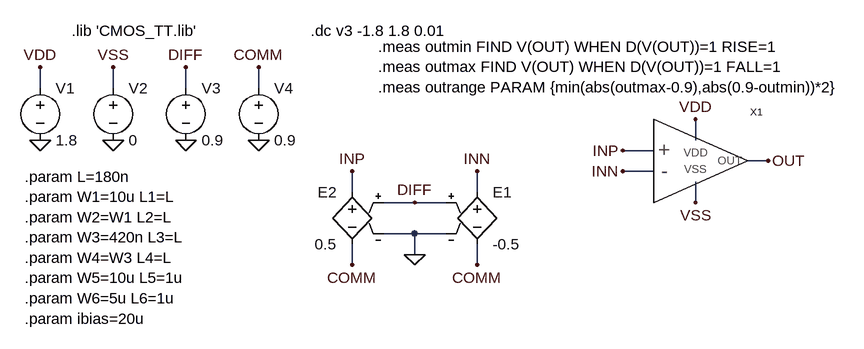
[diagram p0: schematic tb_dc_diff.asc]
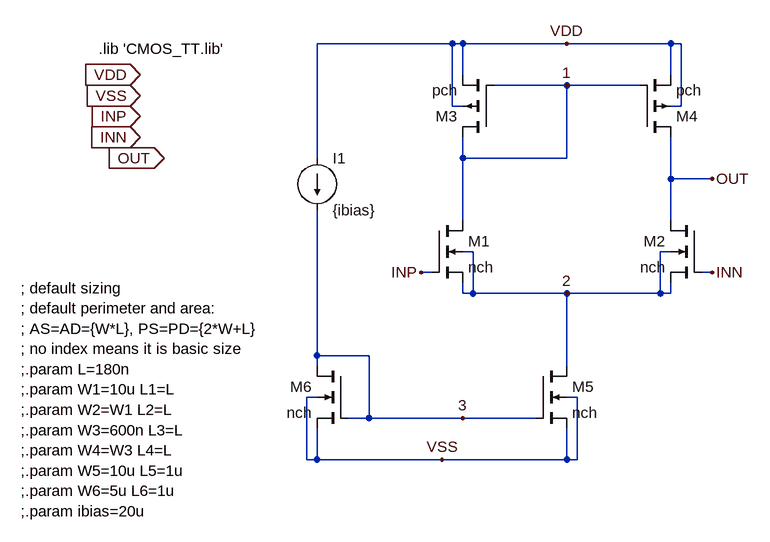
[diagram p1: sub-circuit opamp1stage_good.asc]
tb_dc_diff.asc, the LTspice schematic file:
Version 4
SHEET 1 1168 680
WIRE -176 -96 -176 -128
WIRE -64 -96 -64 -128
WIRE 48 -96 48 -128
WIRE 160 -96 160 -128
WIRE 832 -16 832 -48
WIRE 768 0 720 0
WIRE 944 16 912 16
WIRE 768 32 720 32
WIRE 304 64 304 32
WIRE 496 64 496 32
WIRE 400 80 352 80
WIRE 448 80 400 80
WIRE 832 80 832 48
WIRE 400 128 352 128
WIRE 448 128 400 128
WIRE 400 160 400 128
WIRE 304 176 304 144
WIRE 496 176 496 144
FLAG -176 -16 0
FLAG -64 -16 0
FLAG -176 -128 VDD
FLAG -64 -128 VSS
FLAG 832 -48 VDD
FLAG 832 80 VSS
FLAG 944 16 OUT
FLAG 48 -16 0
FLAG 48 -128 DIFF
FLAG 720 0 INP
FLAG 720 32 INN
FLAG 160 -16 0
FLAG 160 -128 COMM
FLAG 304 176 COMM
FLAG 496 176 COMM
FLAG 400 160 0
FLAG 400 80 DIFF
FLAG 304 32 INP
FLAG 496 32 INN
SYMBOL voltage -176 -112 R0
WINDOW 123 0 0 Left 0
WINDOW 39 0 0 Left 0
SYMATTR InstName V1
SYMATTR Value 1.8
SYMBOL voltage -64 -112 R0
WINDOW 123 0 0 Left 0
WINDOW 39 0 0 Left 0
SYMATTR InstName V2
SYMATTR Value 0
SYMBOL opamp1stage_good 816 16 R0
SYMATTR InstName X1
SYMBOL voltage 48 -112 R0
WINDOW 123 0 0 Left 0
WINDOW 39 0 0 Left 0
SYMATTR InstName V3
SYMATTR Value 0.9
SYMBOL voltage 160 -112 R0
WINDOW 123 0 0 Left 0
WINDOW 39 0 0 Left 0
SYMATTR InstName V4
SYMATTR Value 0.9
SYMBOL e 496 48 R0
SYMATTR InstName E1
SYMATTR Value -0.5
SYMBOL e 304 48 M0
SYMATTR InstName E2
SYMATTR Value 0.5
TEXT 240 -184 Left 2 !.dc v3 -1.8 1.8 0.01
TEXT -200 40 Left 2 !.param L=180n\n.param W1=10u L1=L\n.param W2=W1 L2=L\n.param W3=420n L3=L\n.param W4=W3 L4=L\n.param W5=10u L5=1u\n.param W6=5u L6=1u\n.param ibias=20u
TEXT -128 -184 Left 2 !.lib 'CMOS_TT.lib'
TEXT 344 -160 Left 2 !.meas outmin FIND V(OUT) WHEN D(V(OUT))=1 RISE=1\n.meas outmax FIND V(OUT) WHEN D(V(OUT))=1 FALL=1\n.meas outrange PARAM {min(abs(outmax-0.9),abs(0.9-outmin))*2}

opamp1stage_good.asc, the sub-circuit schematic file:
Version 4
SHEET 1 1168 680
WIRE 512 -176 304 -176
WIRE 528 -176 512 -176
WIRE 688 -176 528 -176
WIRE 848 -176 688 -176
WIRE 864 -176 848 -176
WIRE 528 -128 528 -176
WIRE 848 -128 848 -176
WIRE 688 -112 576 -112
WIRE 800 -112 688 -112
WIRE 512 -80 512 -176
WIRE 528 -80 512 -80
WIRE 864 -80 864 -176
WIRE 864 -80 848 -80
WIRE 304 0 304 -176
WIRE 528 0 528 -32
WIRE 688 0 688 -112
WIRE 688 0 528 0
WIRE 848 32 848 -32
WIRE 912 32 848 32
WIRE 528 96 528 0
WIRE 848 96 848 32
WIRE 544 144 528 144
WIRE 848 144 832 144
WIRE 480 176 464 176
WIRE 912 176 896 176
WIRE 528 208 528 192
WIRE 544 208 544 144
WIRE 544 208 528 208
WIRE 688 208 544 208
WIRE 832 208 832 144
WIRE 832 208 688 208
WIRE 848 208 848 192
WIRE 848 208 832 208
WIRE 304 304 304 80
WIRE 384 304 304 304
WIRE 304 320 304 304
WIRE 688 320 688 208
WIRE 304 368 288 368
WIRE 704 368 688 368
WIRE 384 400 384 304
WIRE 384 400 352 400
WIRE 528 400 384 400
WIRE 640 400 528 400
WIRE 288 464 288 368
WIRE 304 464 304 416
WIRE 304 464 288 464
WIRE 496 464 304 464
WIRE 688 464 688 416
WIRE 688 464 496 464
WIRE 704 464 704 368
WIRE 704 464 688 464
FLAG 496 464 VSS
FLAG 464 176 INP
FLAG 912 176 INN
FLAG 688 -176 VDD
FLAG 688 -112 1
FLAG 688 208 2
FLAG 528 400 3
FLAG 912 32 OUT
FLAG 32 -128 VDD
IOPIN 32 -128 In
FLAG 32 -96 VSS
IOPIN 32 -96 In
FLAG 32 -64 INP
IOPIN 32 -64 In
FLAG 32 -32 INN
IOPIN 32 -32 In
FLAG -16 0 OUT
IOPIN -16 0 Out
SYMBOL nmos4 480 96 R0
SYMATTR InstName M1
SYMATTR Value nch
SYMATTR Value2 l={L1} w={W1} ad={W1*L1} as={W1*L1} pd={2*W1+L1} ps={2*W1+L1}
SYMBOL nmos4 896 96 M0
SYMATTR InstName M2
SYMATTR Value nch
SYMATTR Value2 l={L2} w={W2} ad={W2*L2} as={W2*L2} pd={2*W2+L2} ps={2*W2+L2}
SYMBOL pmos4 576 -32 R180
SYMATTR InstName M3
SYMATTR Value pch
SYMATTR Value2 l={L3} w={W3} ad={W3*L3} as={W3*L3} pd={2*W3+L3} ps={2*W3+L3}
SYMBOL pmos4 800 -32 M180
SYMATTR InstName M4
SYMATTR Value pch
SYMATTR Value2 l={L4} w={W4} ad={W4*L4} as={W4*L4} pd={2*W4+L4} ps={2*W4+L4}
SYMBOL nmos4 640 320 R0
SYMATTR InstName M5
SYMATTR Value nch
SYMATTR Value2 l={L5} w={W5} ad={W5*L5} as={W5*L5} pd={2*W5+L5} ps={2*W5+L5}
SYMBOL nmos4 352 320 M0
SYMATTR InstName M6
SYMATTR Value nch
SYMATTR Value2 l={L6} w={W6} ad={W6*L6} as={W6*L6} pd={2*W6+L6} ps={2*W6+L6}
SYMBOL current 304 0 R0
WINDOW 123 0 0 Left 0
WINDOW 39 0 0 Left 0
SYMATTR InstName I1
SYMATTR Value {ibias}
TEXT -32 -168 Left 2 !.lib 'CMOS_TT.lib'
TEXT -152 200 Left 2 !; default sizing\n; default perimeter and area:\n; AS=AD={W*L}, PS=PD={2*W+L}\n; no index means it is basic size\n;.param L=180n\n;.param W1=10u L1=L\n;.param W2=W1 L2=L\n;.param W3=600n L3=L\n;.param W4=W3 L4=L\n;.param W5=10u L5=1u\n;.param W6=5u L6=1u\n;.param ibias=20u

The netlist it stands for:
* tb_dc_diff.asc
V1 VDD 0 1.8
V2 VSS 0 0
XX1 OUT INP INN VDD VSS opamp1stage_good
V3 DIFF 0 0.9
V4 COMM 0 0.9
E1 INN COMM DIFF 0 -0.5
E2 INP COMM DIFF 0 0.5

* block symbol definitions
.subckt opamp1stage_good OUT INP INN VDD VSS
M1 1 INP 2 2 nch l={L1} w={W1} ad={W1*L1} as={W1*L1} pd={2*W1+L1} ps={2*W1+L1}
M2 OUT INN 2 2 nch l={L2} w={W2} ad={W2*L2} as={W2*L2} pd={2*W2+L2} ps={2*W2+L2}
M3 1 1 VDD VDD pch l={L3} w={W3} ad={W3*L3} as={W3*L3} pd={2*W3+L3} ps={2*W3+L3}
M4 OUT 1 VDD VDD pch l={L4} w={W4} ad={W4*L4} as={W4*L4} pd={2*W4+L4} ps={2*W4+L4}
M5 2 3 VSS VSS nch l={L5} w={W5} ad={W5*L5} as={W5*L5} pd={2*W5+L5} ps={2*W5+L5}
M6 3 3 VSS VSS nch l={L6} w={W6} ad={W6*L6} as={W6*L6} pd={2*W6+L6} ps={2*W6+L6}
I1 VDD 3 {ibias}
.lib 'CMOS_TT.lib'
; default sizing
; default perimeter and area:
; AS=AD={W*L}, PS=PD={2*W+L}
; no index means it is basic size
;.param L=180n
;.param W1=10u L1=L
;.param W2=W1 L2=L
;.param W3=600n L3=L
;.param W4=W3 L4=L
;.param W5=10u L5=1u
;.param W6=5u L6=1u
;.param ibias=20u
.ends opamp1stage_good

.model NMOS NMOS
.model PMOS PMOS
.lib standard.mos
.dc v3 -1.8 1.8 0.01
.param L=180n
.param W1=10u L1=L
.param W2=W1 L2=L
.param W3=420n L3=L
.param W4=W3 L4=L
.param W5=10u L5=1u
.param W6=5u L6=1u
.param ibias=20u
.lib 'CMOS_TT.lib'
.meas outmin FIND V(OUT) WHEN D(V(OUT))=1 RISE=1
.meas outmax FIND V(OUT) WHEN D(V(OUT))=1 FALL=1
.meas outrange PARAM {min(abs(outmax-0.9),abs(0.9-outmin))*2}
.backanno
.end

* Results of the author's LTspice run, read from the files saved beside the schematic
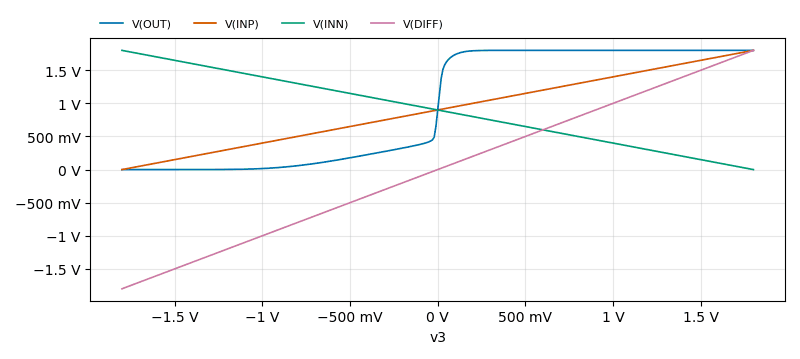
[diagram p2: DC transfer characteristic of tb_dc_diff.asc, plotted from the saved traces]
* DC transfer characteristic, 1 run:
*   V(OUT): 888.4 nV at v3=-1.8 V, 1.8 V at v3=1.8 V, min 888.4 nV, max 1.8 V
*   V(INP): 0 V at v3=-1.8 V, 1.8 V at v3=1.8 V, min 0 V, max 1.8 V
*   V(INN): 1.8 V at v3=-1.8 V, 0 V at v3=1.8 V, min 0 V, max 1.8 V
*   V(DIFF): -1.8 V at v3=-1.8 V, 1.8 V at v3=1.8 V, min -1.8 V, max 1.8 V
* From the log:
*   outmin: v(out)=0.418838 at -0.0508014
*   outmax: v(out)=1.7493 at 0.110815
*   outrange: (min(abs(outmax-0.9),abs(0.9-outmin))*2)=0.962325